# EasyEDA schematic ECE411.json
TITLE: Audio Spectrum Visualizer; REV: 1.2; Date: 11-21-2019; Sheet: 1/1; Drawn By: mchalona; Company: ECE411
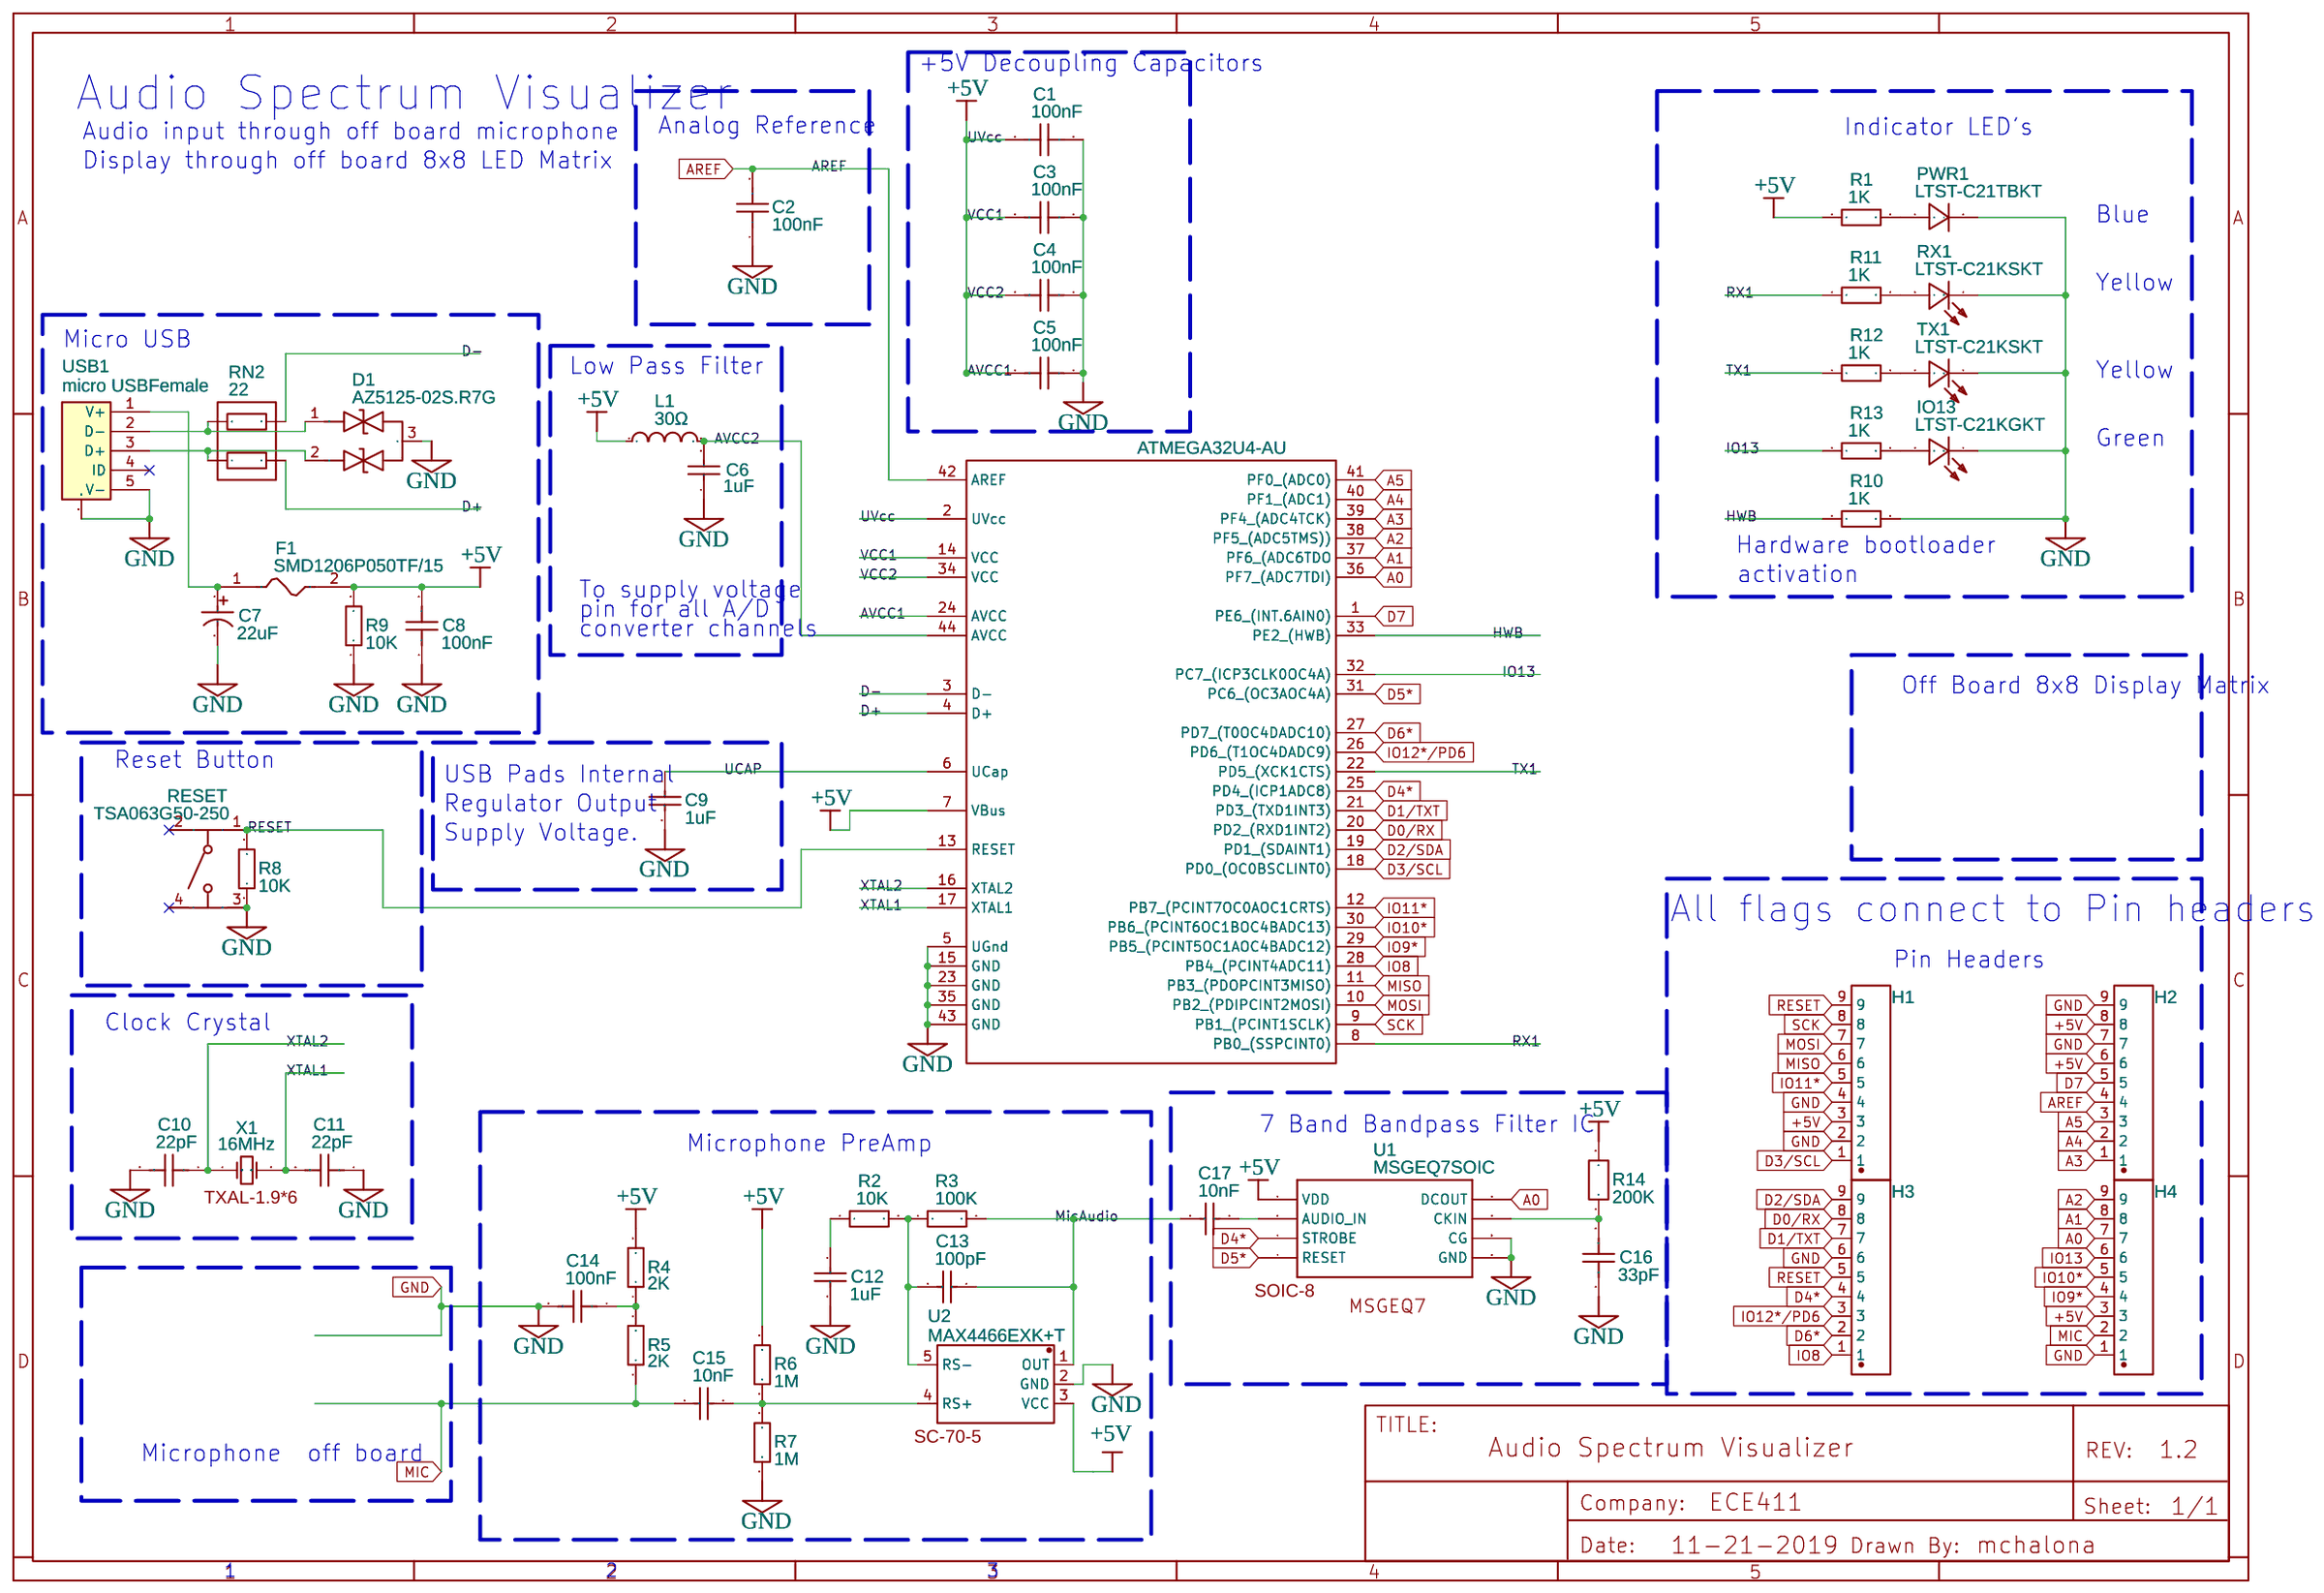
[diagram p0: schematic sheet]

## Parts
ATMEGA32U4  ATMEGA32U4-AU  [QFP-44_10X10X08P]
C1  100nF  [0603]
C2  100nF  [0603]
C3  100nF  [0603]
C4  100nF  [0603]
C5  100nF  [0603]
C6  1uF  [0603]
C7  22uF  [CAP-SMD_BD5.0-L5.3-W5.3-FD]
C8  100nF  [0603]
C9  1uF  [0603]
C10  22pF  [CAP_0603]
C11  22pF  [CAP_0603]
C12  1uF  [0603]
C13  100pF  [0603]
C14  100nF  [0603]
C15  10nF  [0603]
C16  33pF  [0603]
C17  10nF  [0603]
D1  AZ5125-02S.R7G  [SOT-23-3_L2.9-W1.6-P1.90-LS2.8-BR]
F1  SMD1206P050TF/15  [FUSE-1206]
H1  A2541WV-9P  [SIP-2.54MM-9P-CJT-H8.54]
H2  A2541WV-9P  [SIP-2.54MM-9P-CJT-H8.54]
H3  A2541WV-9P  [SIP-2.54MM-9P-CJT-H8.54]
H4  A2541WV-9P  [SIP-2.54MM-9P-CJT-H8.54]
IO13  LTST-C21KGKT  [LED-SMD-3.2X1.6X1.1]
L1  30Ω  [0805]
PWR1  LTST-C21TBKT  [LED-SMD-3.2X1.6X1.1]
R1  1K  [0603]
R2  10K  [0603]
R3  100K  [0603]
R4  2K  [0603]
R5  2K  [0603]
R6  1M  [0603]
R7  1M  [0603]
R8  10K  [0603]
R9  10K  [0603]
R10  1K  [0603]
R11  1K  [0603]
R12  1K  [0603]
R13  1K  [0603]
R14  200K  [R0603]
RESET  TSA063G50-250  [SW-SMD-T6X6-9.5X5.8]
RN2  22  [RES-ARRAY-SMD_0402-4P-L1.0-W1.0-BL]
RX1  LTST-C21KSKT  [LED-SMD-3.2X1.6X1.1]
TX1  LTST-C21KSKT  [LED-SMD-3.2X1.6X1.1]
U1  MSGEQ7SOIC  [SOIC-8]
U2  MAX4466EXK+T  [SC-70-5]
USB1  micro USBFemale  [MICRO-USB-1]
X1  16MHz  [TXAL-1.9*6]

## Library data of the parts
ATMEGA32U4 = -: Supplier: LCSC; Manufacturer: MICROCHIP; image: //image.lceda.cn/szlcsc/C44854.jpg; Supplier Part: C44854; LCSC Assembly: Yes; SMT Type: Extend
C1-C5 C8 C14 = 0603B104J500NT: Supplier: LCSC; Manufacturer: FH; Supplier Part: C88136
C6 C12 = CL10A105KP8NNNC: Supplier: LCSC; Manufacturer: SAMSUNG; Supplier Part: C26413
C7 = RVT1V220M0505-C23289: Supplier: LCSC; Manufacturer: HONOR; Manufacturer Part: RVT1V220M0505; Supplier Part: C23289
C9 = CL10A105KP8NNNC: Supplier: LCSC; Manufacturer: SAMSUNG; Supplier Part: C26413; Package Display: No
C10 C11 = 0603N220F500CT: Supplier: LCSC; Supplier Part: C388038; Manufacturer: Walsin Tech Corp; Contributor: LCSC
C13 = 0603CG101J500NT: Supplier: LCSC; Manufacturer: FH; Supplier Part: C1635; LCSC Assembly: Yes; SMT Type: Extend
C15 C17 = 0603B103J500NT: Supplier: LCSC; Manufacturer: FH; Contributor: LCSC; Supplier Part: C124567
C16 = 0603N330F500CT: Supplier: LCSC; Supplier Part: C296062; Manufacturer: Walsin Tech Corp; Contributor: LCSC
D1 = -: Supplier: LCSC; Supplier Part: C356820; Manufacturer: AMAZING; Contributor: LCSC
F1 = -: Supplier: LCSC; Manufacturer: PTTC; Supplier Part: C106264
H1-H4 = -: Supplier: LCSC; Supplier Part: C225484; Manufacturer: Changjiang Connectors; Contributor: LCSC
IO13 = -: Supplier: LCSC; Supplier Part: C284938; Manufacturer: Lite-On; Contributor: LCSC
L1 = MLB2012-300P3A(f): Supplier: LCSC; Manufacturer: ReliaPro; Supplier Part: C50503
PWR1 = -: Supplier: LCSC; Supplier Part: C284941; Manufacturer: Lite-On; Contributor: LCSC
R1 R10-R13 = RS-03K1001FT: Supplier: LCSC; Manufacturer: FH; Supplier Part: C115325
R2 R8 R9 = RTT031002BTP: Supplier: LCSC; Supplier Part: C305012; Manufacturer: RALEC; Contributor: LCSC
R3 = RC0603FR-07100KL: Supplier: LCSC; Supplier Part: C14675; Manufacturer: YAGEO; Contributor: LCSC
R4 R5 = RC0603FR-072KL: Supplier: LCSC; Manufacturer: YAGEO; Supplier Part: C105576
R6 R7 = RC0603FR-071ML: Supplier: LCSC; Manufacturer: YAGEO; Supplier Part: C105578
R14 = CR0603F200KP05: Supplier: LCSC; Supplier Part: C429255; Manufacturer: Ever Ohms Tech; Contributor: LCSC
RESET = -: Supplier: LCSC; Supplier Part: C294565; Manufacturer: BRIGHT; Contributor: LCSC
RN2 = AF122-JR-0722RL: Supplier: LCSC; Supplier Part: C309445; Manufacturer: YAGEO; Contributor: LCSC
RX1 TX1 = -: Supplier: LCSC; Supplier Part: C284940; Manufacturer: Lite-On; Contributor: LCSC
U1 = -: 7-band graphic equalizer; Contributor: SparkFun; Package Display: Yes
U2 = -: Supplier: LCSC; Supplier Part: C143459; Manufacturer: Maxim Integrated; Manufacturer Part: MAX4073TAXK+T; Contributor: LCSC; LCSC Assembly: Yes; SMT Type: Extend; Package Display: Yes
USB1 = -: Supplier: LCSC; Manufacturer: ValuePro; image: //image.lceda.cn/szlcsc/C10418.jpg; Supplier Part: C10418
X1 = X206016MSD2SC: Supplier: LCSC; Manufacturer: YXC; Supplier Part: C2174; Package Display: Yes

## Nets
+5V: ATMEGA32U4.2(UVcc) ATMEGA32U4.7(VBus) ATMEGA32U4.14(VCC) ATMEGA32U4.24(AVCC) ATMEGA32U4.34(VCC) C1.2 C3.2 C4.2 C5.2 C8.2 F1.2 H1.3 H2.6 H2.8 H4.3 L1.1 R1.1 R4.2 R6.2 R9.2 R14.2 U1.1(VDD) U2.3(VCC)
AVCC2: ATMEGA32U4.44(AVCC) C6.2 L1.2
GND: ATMEGA32U4.5(UGnd) ATMEGA32U4.15(GND) ATMEGA32U4.23(GND) ATMEGA32U4.35(GND) ATMEGA32U4.43(GND) C1.1 C2.1 C3.1 C4.1 C5.1 C6.1 C7.2 C8.1 C9.2 C10.2 C11.1 C12.2 C14.2 C16.1 D1.3 H1.2 H1.4 H2.7 H2.9 H3.6 H4.1 IO13.1(C) PWR1.2(-) R7.1 R8.1 R9.1 R10.2 RESET.3 RX1.1(C) TX1.1(C) U1.2(GND) U1.6(CG) U2.2(GND) USB1.0(MTN) USB1.5(V-)
A0: ATMEGA32U4.36(PF7 (ADC7TDI)) H4.7 U1.3(DCOUT)
A1: ATMEGA32U4.37(PF6 (ADC6TDO) H4.8
A2: ATMEGA32U4.38(PF5 (ADC5TMS))) H4.9
A3: ATMEGA32U4.39(PF4 (ADC4TCK)) H2.1
A4: ATMEGA32U4.40(PF1 (ADC1)) H2.2
A5: ATMEGA32U4.41(PF0 (ADC0)) H2.3
AREF: ATMEGA32U4.42(AREF) C2.2 H2.4
D0/RX: ATMEGA32U4.20(PD2 (RXD1INT2)) H3.8
D1/TXT: ATMEGA32U4.21(PD3 (TXD1INT3)) H3.7
D2/SDA: ATMEGA32U4.19(PD1 (SDAINT1)) H3.9
D3/SCL: ATMEGA32U4.18(PD0 (OC0BSCLINT0)) H1.1
D4*: ATMEGA32U4.25(PD4 (ICP1ADC8)) H3.4 U1.4(STROBE)
D5*: ATMEGA32U4.31(PC6 (OC3AOC4A)) U1.7(RESET)
D6*: ATMEGA32U4.27(PD7 (T0OC4DADC10)) H3.2
D7: ATMEGA32U4.1(PE6 (INT.6AIN0)) H2.5
D+: ATMEGA32U4.4(D+) RN2.1
D-: ATMEGA32U4.3(D-) RN2.2
HWB: ATMEGA32U4.33(PE2 (HWB)) R10.1
IO8: ATMEGA32U4.28(PB4 (PCINT4ADC11)) H3.1
IO9*: ATMEGA32U4.29(PB5 (PCINT5OC1AOC4BADC12)) H4.4
IO10*: ATMEGA32U4.30(PB6 (PCINT6OC1BOC4BADC13)) H4.5
IO11*: ATMEGA32U4.12(PB7 (PCINT7OC0AOC1CRTS)) H1.5
IO12*/PD6: ATMEGA32U4.26(PD6 (T1OC4DADC9)) H3.3
IO13: ATMEGA32U4.32(PC7 (ICP3CLK0OC4A)) H4.6 R13.1
MIC: C15.1 H4.2 R5.1
MicAudio: C13.1 C17.1 R3.2 U2.1(OUT)
MISO: ATMEGA32U4.11(PB3 (PDOPCINT3MISO)) H1.6
MOSI: ATMEGA32U4.10(PB2 (PDIPCINT2MOSI)) H1.7
RESET: ATMEGA32U4.13(RESET) H1.9 H3.5 R8.2 RESET.1
RX1: ATMEGA32U4.8(PB0 (SSPCINT0)) R11.1
SCK: ATMEGA32U4.9(PB1 (PCINT1SCLK)) H1.8
TX1: ATMEGA32U4.22(PD5 (XCK1CTS)) R12.1
UCAP: ATMEGA32U4.6(UCap) C9.1
XTAL1: ATMEGA32U4.17(XTAL1) C11.2 X1.2(OSC2)
XTAL2: ATMEGA32U4.16(XTAL2) C10.1 X1.1(OSC1)
Net-(C7-1): C7.1 F1.1 USB1.1(V+)
Net-(C12-1): C12.1 R2.1
Net-(C13-2): C13.2 R2.2 R3.1 U2.5(RS-)
Net-(C14-1): C14.1 R4.1 R5.2
Net-(C15-2): C15.2 R6.1 R7.2 U2.4(RS+)
Net-(C16-2): C16.2 R14.1 U1.8(CKIN)
Net-(C17-2): C17.2 U1.5(AUDIO_IN)
Net-(D1-1): D1.1 RN2.3 USB1.2(D-)
Net-(D1-2): D1.2 RN2.4 USB1.3(D+)
Net-(IO13-2): IO13.2(A) R13.2
Net-(PWR1-1): PWR1.1(+) R1.2
Net-(R11-2): R11.2 RX1.2(A)
Net-(R12-2): R12.2 TX1.2(A)

Not connected (* = marked no-connect by the designer): RESET 2* 4*; USB1 4(ID)*

## Notes on the sheet
- +5V Decoupling Capacitors
- Audio Spectrum Visualizer
- Audio input through off board microphone
- Analog Reference
- Indicator LED's
- Display through off board 8x8 LED Matrix
- Blue
- Yellow
- Micro USB
- Low Pass Filter
- Yellow
- Green
- Hardware bootloader
- activation
- To supply voltage
- converter channels
- pin for all A/D
- Off Board 8x8 Display Matrix
- Reset Button
- USB Pads Internal
- Regulator Output
- Supply Voltage.
- All flags connect to Pin headers
- Pin Headers
- Clock Crystal
- 7 Band Bandpass Filter IC
- Microphone PreAmp
- Microphone  off board
- 1
- 2
- 3
